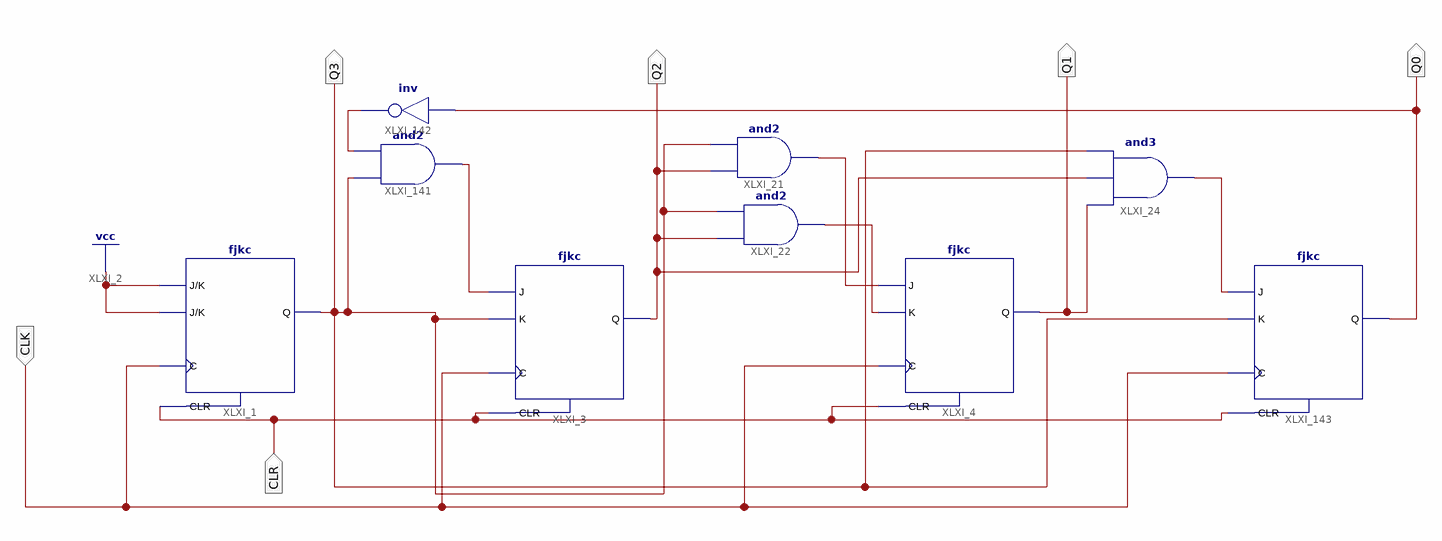
[diagram p0: schematic sheet 1]
// Xilinx ISE schematic CounterCLR.sch (spartan6) as structural Verilog: 9 symbols, 6 ports
module CounterCLR (
  input  CLK,
  input  CLR,
  output Q3,
  output Q2,
  output Q0,
  output Q1
);

  wire XLXN_28, XLXN_35, XLXN_48, XLXN_53, XLXN_240;

  fjkc XLXI_1 (.C(CLK), .CLR(CLR), .J(1'b1), .K(1'b1), .Q(Q3));
  fjkc XLXI_4 (.C(CLK), .CLR(CLR), .J(XLXN_48), .K(XLXN_28), .Q(Q1));
  and XLXI_22 (XLXN_28, Q2, Q3);
  and XLXI_21 (XLXN_48, Q2, Q3);
  fjkc XLXI_3 (.C(CLK), .CLR(CLR), .J(XLXN_35), .K(Q3), .Q(Q2));
  and XLXI_24 (XLXN_53, Q1, Q2, Q3);
  and XLXI_141 (XLXN_35, Q3, XLXN_240);
  not XLXI_142 (XLXN_240, Q0);
  fjkc XLXI_143 (.C(CLK), .CLR(CLR), .J(XLXN_53), .K(Q3), .Q(Q0));
endmodule
